# Altium schematic sheet PetLaserBolt.SchDoc
size A
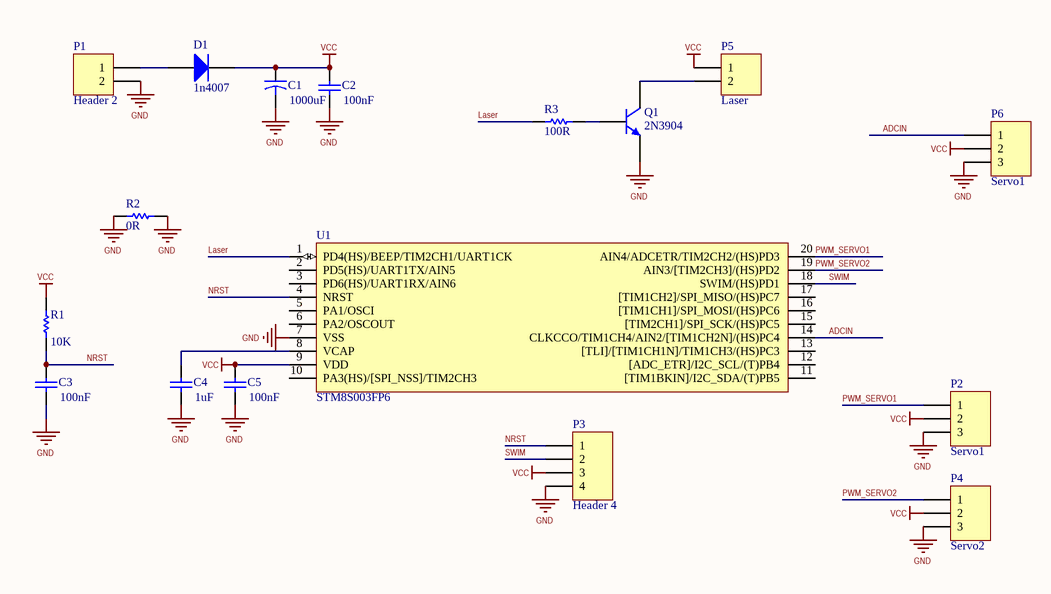
[diagram p0: PetLaserBolt.SchDoc]

## Parts
C1  value 1000uF  [Cap electrolitic radial 10x16-5]  (hidden comment: Cap2)
C2  value 100nF  [CAP_MLCC_RAD_0.1]  (hidden comment: Cap)
C3  value 100nF  [CAP_MLCC_RAD_0.1]  (hidden comment: Cap)
C4  value 1uF  [CAP_MLCC_RAD_0.1]  (hidden comment: Cap)
C5  value 100nF  [CAP_MLCC_RAD_0.1]  (hidden comment: Cap)
D1  1n4007  [DO-204AL]
P1  Header 2  [KF301 2PIN]
P2  Servo1  [HDR_1x3]
P3  Header 4  [HDR1X4]
P4  Servo2  [HDR_1x3]
P5  Laser  [KF301 2PIN]
P6  Servo1  [HDR_1x3]
Q1  2N3904  [TO-92 STR]
R1  value 10K  [Axial 0_25 W, 0_4 IN LEAD PITCH]  (hidden comment: Res1)
R2  value 0R  [axial-0.3]  (hidden comment: Res1)
R3  value 100R  [Axial 0_25 W, 0_4 IN LEAD PITCH]  (hidden comment: Res1)
U1  STM8S003FP6  [TSSOP20]

## Nets
GND: C1.2 C2.1 C3.1 C4.1 C5.1 P1.2 P2.3 P3.4 P4.3 P6.3 Q1.1(E) R2.1 R2.2 U1.7(VSS)
VCC: C1.1 C2.2 C5.2 D1.2(K) P2.2 P3.3 P4.2 P5.1 P6.2 R1.2 U1.9(VDD)
ADCIN: P6.1 U1.14(CLKCCO/TIM1CH4/AIN2/[TIM1CH2N]/(HS)PC4)
Laser: R3.2 U1.1(PD4(HS)/BEEP/TIM2CH1/UART1CK)
NRST: C3.2 P3.1 R1.1 U1.4(NRST)
PWM_SERVO1: P2.1 U1.20(AIN4/ADCETR/TIM2CH2/(HS)PD3)
PWM_SERVO2: P4.1 U1.19(AIN3/[TIM2CH3]/(HS)PD2)
SWIM: P3.2 U1.18(SWIM/(HS)PD1)
NetC4_2: C4.2 U1.8(VCAP)
NetD1_1: D1.1(A) P1.1
NetP5_2: P5.2 Q1.3(C)
NetQ1_2: Q1.2(B) R3.1

Not connected (* = marked no-connect by the designer): U1 2(PD5(HS)/UART1TX/AIN5) 3(PD6(HS)/UART1RX/AIN6) 5(PA1/OSCI) 6(PA2/OSCOUT) 10(PA3(HS)/[SPI_NSS]/TIM2CH3) 11([TIM1BKIN]/I2C_SDA/(T)PB5) 12([ADC_ETR]/I2C_SCL/(T)PB4) 13([TLI]/[TIM1CH1N]/TIM1CH3/(HS)PC3) 15([TIM2CH1]/SPI_SCK/(HS)PC5) 16([TIM1CH1]/SPI_MOSI/(HS)PC6) 17([TIM1CH2]/SPI_MISO/(HS)PC7)

## Library data of the parts
C1 = Cap2: Capacitor; Published: 23-Sep-2002; PackageReference: CAPR5-4X5; Publisher: Altium Limited; PackageDescription: Capacitor; 2 Leads
C2-C5 = Cap: Capacitor; Published: 8-Jun-2000; LatestRevisionDate: 17-Jul-2002; LatestRevisionNote: Re-released for DXP Platform.; PackageReference: RAD-0.3; Publisher: Altium Limited; PackageDescription: Radial Cap, Thru-Hole; 2 Leads; 0.3 in Pin Spacing
D1 = Diode: Default Diode; Published: 8-Jun-2000; LatestRevisionDate: 17-Jul-2002; LatestRevisionNote: Re-released for DXP Platform.; PackageVersion: Sep-1996; PackageReference: SMC; Publisher: Altium Limited; PackageDescription: DO-214-AB/SMC; 2 C-Bend Leads; Body 7.9 x 5.9 mm, inc. leads (LxW); Code_JEDEC: DO-214-AB
P1 P5 = Header 2: Header, 2-Pin; LatestRevisionDate: 17-Jul-2002; LatestRevisionNote: Re-released for DXP Platform.; Publisher: Altium Limited
P2 P4 P6 = Header 3: Header, 3-Pin; LatestRevisionDate: 17-Jul-2002; LatestRevisionNote: Re-released for DXP Platform.; Publisher: Altium Limited
P3 = Header 4: Header, 4-Pin; LatestRevisionDate: 17-Jul-2002; LatestRevisionNote: Re-released for DXP Platform.; Publisher: Altium Limited
Q1 = 2N3904: NPN General Purpose Amplifier; Published: 8-Jun-2000; LatestRevisionDate: 15-Jan-2003; LatestRevisionNote: PCB Footprint 'BCY-W3/D4.7' replaced; DatasheetVersion: 1997; PackageVersion: Sep-1998; PackageReference: TO-92A; Publisher: Altium Limited; PackageDescription: TO, Flat Index; 3 In-Line, Axial Leads; Body Dia. 4.5mm; Leads 0.51 x 0.48 mm (max); ComponentLink1Description: Manufacturer Link; ComponentLink1URL: http://www.fairchildsemi.com/; ComponentLink2Description: Datasheet; ComponentLink2URL: http://www.fairchildsemi.com/ds/2N%2F2N3904.pdf
R1-R3 = Res1: Resistor; Published: 8-Jun-2000; LatestRevisionDate: 17-Jul-2002; LatestRevisionNote: Re-released for DXP Platform.; PackageReference: AXIAL-0.3; Publisher: Altium Limited; PackageDescription: Axial Device, Thru-Hole; 2 Leads; 0.3 in Pin Spacing
U1 = STM8S003F3Px: 8 bit microcontroller